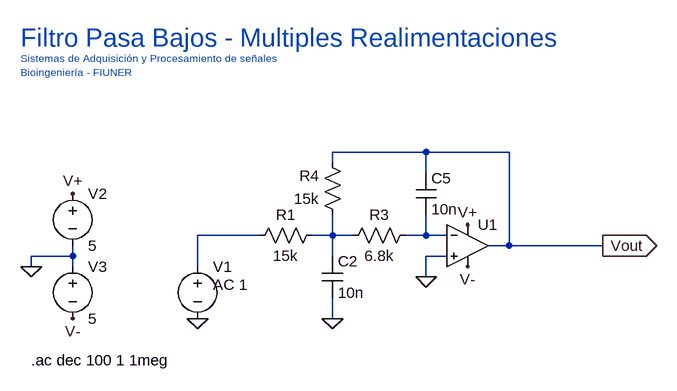
[diagram p0: schematic Analisis_Frecuencial_MFB_PasaBajos.asc]
Analisis_Frecuencial_MFB_PasaBajos.asc, the LTspice schematic file:
Version 4
SHEET 1 880 680
WIRE 304 48 160 48
WIRE 432 48 304 48
WIRE 160 64 160 48
WIRE 304 80 304 48
WIRE 48 176 -48 176
WIRE 160 176 160 144
WIRE 160 176 128 176
WIRE 192 176 160 176
WIRE 304 176 304 144
WIRE 304 176 272 176
WIRE 336 176 304 176
WIRE 432 192 432 48
WIRE 432 192 400 192
WIRE 576 192 432 192
WIRE -240 208 -240 192
WIRE -240 208 -304 208
WIRE 160 208 160 176
WIRE 336 208 304 208
WIRE -304 224 -304 208
WIRE -240 224 -240 208
WIRE -48 224 -48 176
WIRE 304 240 304 208
WIRE 160 304 160 272
FLAG 368 160 V+
FLAG 368 224 V-
FLAG -48 304 0
FLAG -304 224 0
FLAG -240 304 V-
FLAG -240 112 V+
FLAG 576 192 Vout
IOPIN 576 192 Out
FLAG 304 240 0
FLAG 160 304 0
SYMBOL Opamps\\UniversalOpamp2 368 192 R0
SYMATTR InstName U1
SYMBOL voltage -48 208 R0
WINDOW 123 24 44 Left 2
WINDOW 39 0 0 Left 2
SYMATTR Value2 AC 1
SYMATTR InstName V1
SYMATTR Value ""
SYMBOL voltage -240 96 R0
WINDOW 123 0 0 Left 2
WINDOW 39 0 0 Left 2
SYMATTR InstName V2
SYMATTR Value 5
SYMBOL voltage -240 208 R0
WINDOW 123 0 0 Left 2
WINDOW 39 0 0 Left 2
SYMATTR InstName V3
SYMATTR Value 5
SYMBOL cap 288 80 R0
SYMATTR InstName C5
SYMATTR Value 10n
SYMBOL res 288 160 R90
WINDOW 0 0 56 VBottom 2
WINDOW 3 32 56 VTop 2
SYMATTR InstName R3
SYMATTR Value 6.8k
SYMBOL res 144 160 R90
WINDOW 0 0 56 VBottom 2
WINDOW 3 32 56 VTop 2
SYMATTR InstName R1
SYMATTR Value 15k
SYMBOL cap 144 208 R0
SYMATTR InstName C2
SYMATTR Value 10n
SYMBOL res 176 160 R180
WINDOW 0 36 76 Left 2
WINDOW 3 36 40 Left 2
SYMATTR InstName R4
SYMATTR Value 15k
TEXT -304 368 Left 2 !.ac dec 100 1 1meg
TEXT -320 -128 Left 4 ;Filtro Pasa Bajos - Multiples Realimentaciones
TEXT -320 -96 Left 1 ;Sistemas de Adquisición y Procesamiento de señales\nBioingeniería - FIUNER

The netlist it stands for:
* Analisis_Frecuencial_MFB_PasaBajos.asc
XU1 0 N003 V+ V- Vout level.2 Avol=1Meg GBW=10Meg Slew=10Meg ilimit=25m rail=0 Vos=0 phimargin=45 en=0 enk=0 in=0 ink=0 Rin=500Meg  ; pins IN+ IN- V+ V- OUT
V1 N001 0 AC 1
V2 V+ 0 5
V3 0 V- 5
C5 Vout N003 10n
R3 N003 N002 6.8k
R1 N002 N001 15k
C2 N002 0 10n
R4 N002 Vout 15k
.ac dec 100 1 1meg
* Filtro Pasa Bajos - Multiples Realimentaciones
* Sistemas de Adquisición y Procesamiento de señales
* Bioingeniería - FIUNER
.lib UniversalOpamps2.sub
.backanno
.end